# EAGLE design MovingTargetUnit_v4 (EAGLE 9.6.2)
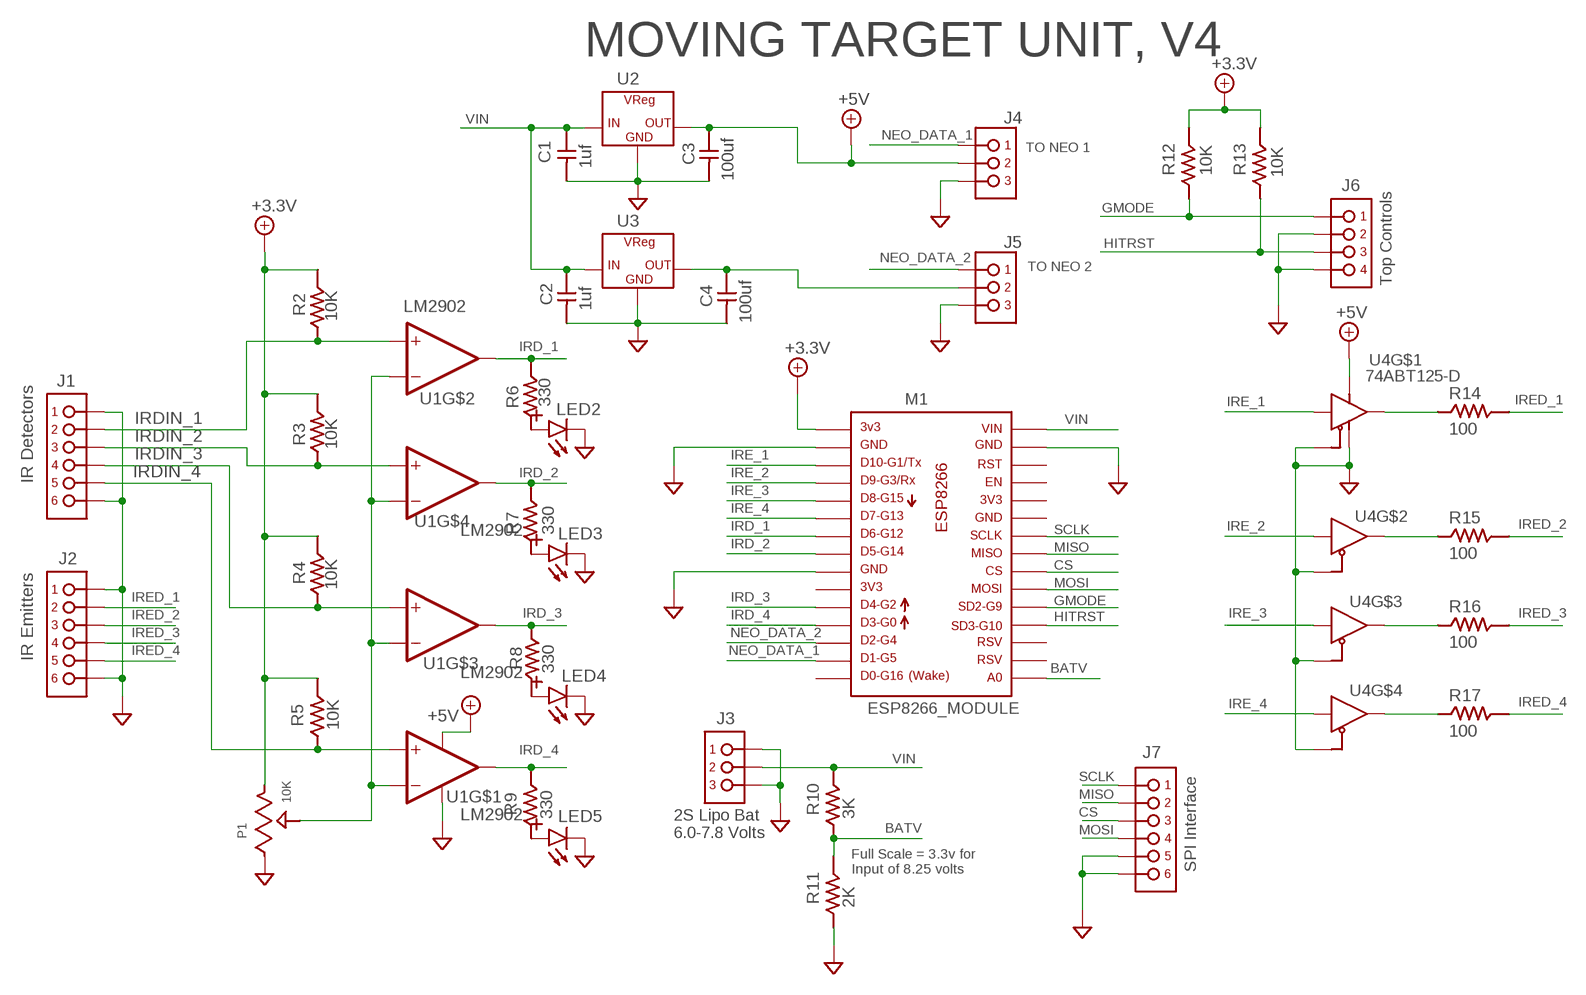
[diagram p0: schematic, sheet 1]

## Parts
C1  1uf  CAP1206  [C1206]
C2  1uf  CAP1206  [C1206]
C3  100uf  CAP1206  [C1206]
C4  100uf  CAP1206  [C1206]
J1  PINHDR_1X6-JST  [JST-XH_098_VERT_1X6]
J2  PINHDR_1X6-JST  [JST-XH_098_VERT_1X6]
J3  PINHDR_1X3XH-JST  [JST-XH_098_VERT_1X3]
J4  PINHDR_1X3XH-JST  [JST-XH_098_VERT_1X3]
J5  PINHDR_1X3XH-JST  [JST-XH_098_VERT_1X3]
J6  PINHDR_1X4-JST  [JST-XH_098_VERT_1X4]
J7  PINHDR_1X6-JST  [JST-XH_098_VERT_1X6]
LED2  LED1206  [LED_1206]
LED3  LED1206  [LED_1206]
LED4  LED1206  [LED_1206]
LED5  LED1206  [LED_1206]
M1  ESP8266_MODULE  [ESP8266_MODULE]
P1  10K  TRIMPOT-SM  [TRIMPOT_3361P]
R2  10K  R1206(3216METRIC)  [R1206]
R3  10K  R1206(3216METRIC)  [R1206]
R4  10K  R1206(3216METRIC)  [R1206]
R5  10K  R1206(3216METRIC)  [R1206]
R6  330  R1206(3216METRIC)  [R1206]
R7  330  R1206(3216METRIC)  [R1206]
R8  330  R1206(3216METRIC)  [R1206]
R9  330  R1206(3216METRIC)  [R1206]
R10  3K  R1206(3216METRIC)  [R1206]
R11  2K  R1206(3216METRIC)  [R1206]
R12  10K  R1206(3216METRIC)  [R1206]
R13  10K  R1206(3216METRIC)  [R1206]
R14  100  R1206(3216METRIC)  [R1206]
R15  100  R1206(3216METRIC)  [R1206]
R16  100  R1206(3216METRIC)  [R1206]
R17  100  R1206(3216METRIC)  [R1206]
U1  LM2902  [SO16LNB-14PIN]
U2  VREG-3L7805CDT  [TO252-3]
U3  VREG-3L7805CDT  [TO252-3]
U4  74ABT125-D  [SO16LNB-14PIN]

## Nets
+3.3V: M1.P$1 P1.3 R2.P$2 R3.P$2 R4.P$2 R5.P$2 R12.P$2 R13.P$2
+5V: C3.P$2 J4.2 U1.P$4(P+) U2.3(OUT) U4.P$14(VCC)
BATV: M1.P$16 R10.P$1 R11.P$2
CS: J7.4 M1.P$22
GMODE: J6.1 M1.P$20 R12.P$1
GND: C1.P$1 C2.P$1 C3.P$1 C4.P$1 J1.1 J1.6 J2.1 J2.6 J3.1 J3.3 J4.1 J5.1 J6.2 J6.4 J7.1 J7.2 LED2.CATHODE(-)(CATHODE) LED3.CATHODE(-)(CATHODE) LED4.CATHODE(-)(CATHODE) LED5.CATHODE(-)(CATHODE) M1.P$2 M1.P$9 M1.P$29 P1.1 R11.P$1 U1.P$11(P-) U2.FIN(GND) U3.FIN(GND) U4.P$1(OE) U4.P$4(OE) U4.P$7(GND) U4.P$10(OE) U4.P$13(OE)
HITRST: J6.3 M1.P$19 R13.P$1
IRD_1: M1.P$7 R6.P$2 U1.P$7(OUT)
IRD_2: M1.P$8 R7.P$2 U1.P$14(OUT)
IRD_3: M1.P$11 R8.P$1 U1.P$8(OUT)
IRD_4: M1.P$12 R9.P$2 U1.P$1(OUT)
IRDIN_1: J1.5 R2.P$1 U1.P$5(+IN)
IRDIN_2: J1.4 R3.P$1 U1.P$12(+IN)
IRDIN_3: J1.3 R4.P$1 U1.P$10(+IN)
IRDIN_4: J1.2 R5.P$1 U1.P$3(+IN)
IRE_1: M1.P$3 U4.P$2(IN)
IRE_2: M1.P$4 U4.P$5(IN)
IRE_3: M1.P$5 U4.P$9(IN)
IRE_4: M1.P$6 U4.P$12(IN)
IRED_1: J2.5 R14.P$2
IRED_2: J2.4 R15.P$2
IRED_3: J2.3 R16.P$2
IRED_4: J2.2 R17.P$2
IREDD_1: R14.P$1 U4.P$3(OUT)
IREDD_2: R15.P$1 U4.P$6(OUT)
IREDD_3: R16.P$1 U4.P$8(OUT)
IREDD_4: R17.P$1 U4.P$11(OUT)
MISO: J7.5 M1.P$23
MOSI: J7.3 M1.P$21
N$1: LED3.ANODE(+)(ANODE) R7.P$1
N$2: LED2.ANODE(+)(ANODE) R6.P$1
N$3: LED4.ANODE(+)(ANODE) R8.P$2
N$4: LED5.ANODE(+)(ANODE) R9.P$1
N$10: P1.2 U1.P$2(-IN) U1.P$6(-IN) U1.P$9(-IN) U1.P$13(-IN)
N$12: C4.P$2 J5.2 U3.3(OUT)
NEO_DATA_1: J4.3 M1.P$14
NEO_DATA_2: J5.3 M1.P$13
SCLK: J7.6 M1.P$24
VIN: C1.P$2 C2.P$2 J3.2 M1.P$30 R10.P$2 U2.1(IN) U3.1(IN)
Unconnected: M1.P$10 M1.P$15 M1.P$17 M1.P$18 M1.P$25 M1.P$26 M1.P$27 M1.P$28

## Notes on the sheet
- MOVING TARGET UNIT, V4
- TO NEO 1
- TO NEO 2
- Top Controls
- IR Detectors
- IR Emitters
- 2S Lipo Bat
  6.0-7.8 Volts
- SPI Interface
- Full Scale = 3.3v for 
  Input of 8.25 volts

## Library data of the parts
C1-C4 = Dal_V2:CAP
J1 J2 J7 = Dal_V2:PINHDR_1X6
J3-J5 = Dal_V2:PINHDR_1X3
J6 = Dal_V2:PINHDR_1X4
LED2-LED5 = Dal_V2:LED: Standard LED
M1 = Dal_V2:ESP8266_MODULE
P1 = Dal_V2:TRIMPOT
R2-R17 = Dal_V2:R: Standard Resistor -- Various Sizes and Wattages
U1 = Dal_V2:LM2902: Texas Instruments, LM2902KD
U2 U3 = Dal_V2:VREG-3: 3 Pin Voltage Regulator
U4 = Dal_V2:74ABT125

## Board
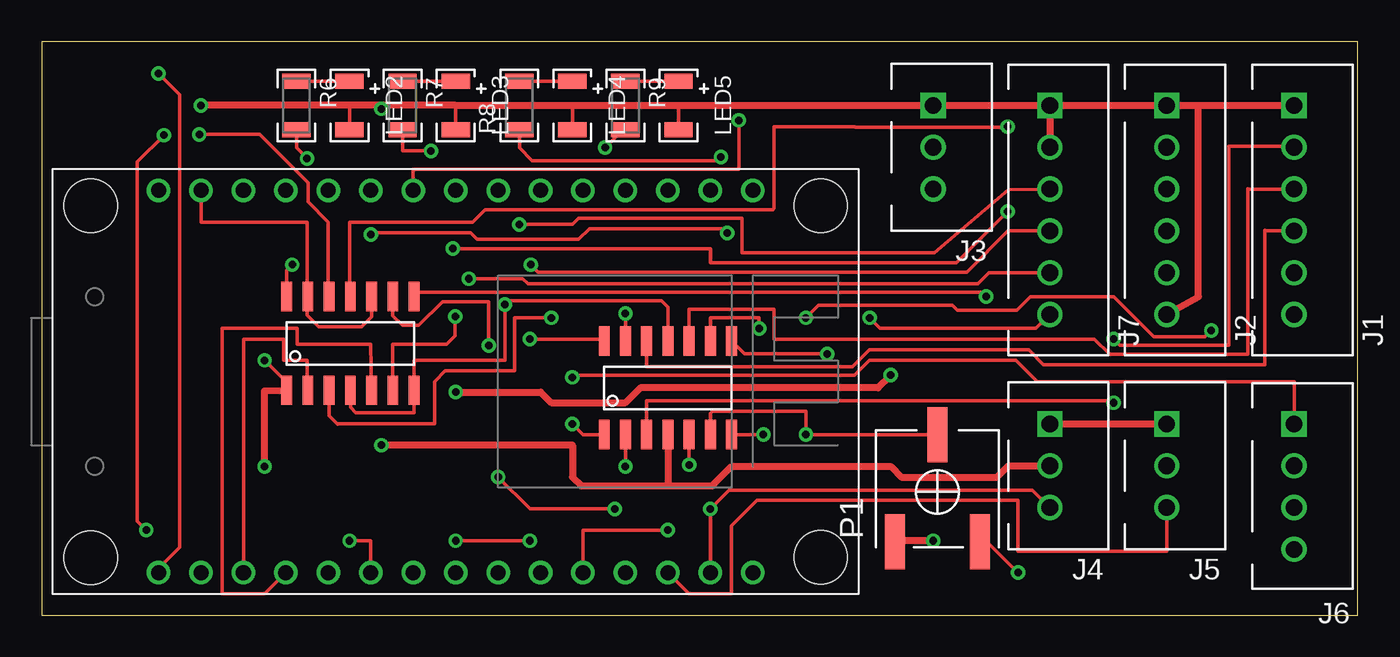
[diagram p1: board, top side]
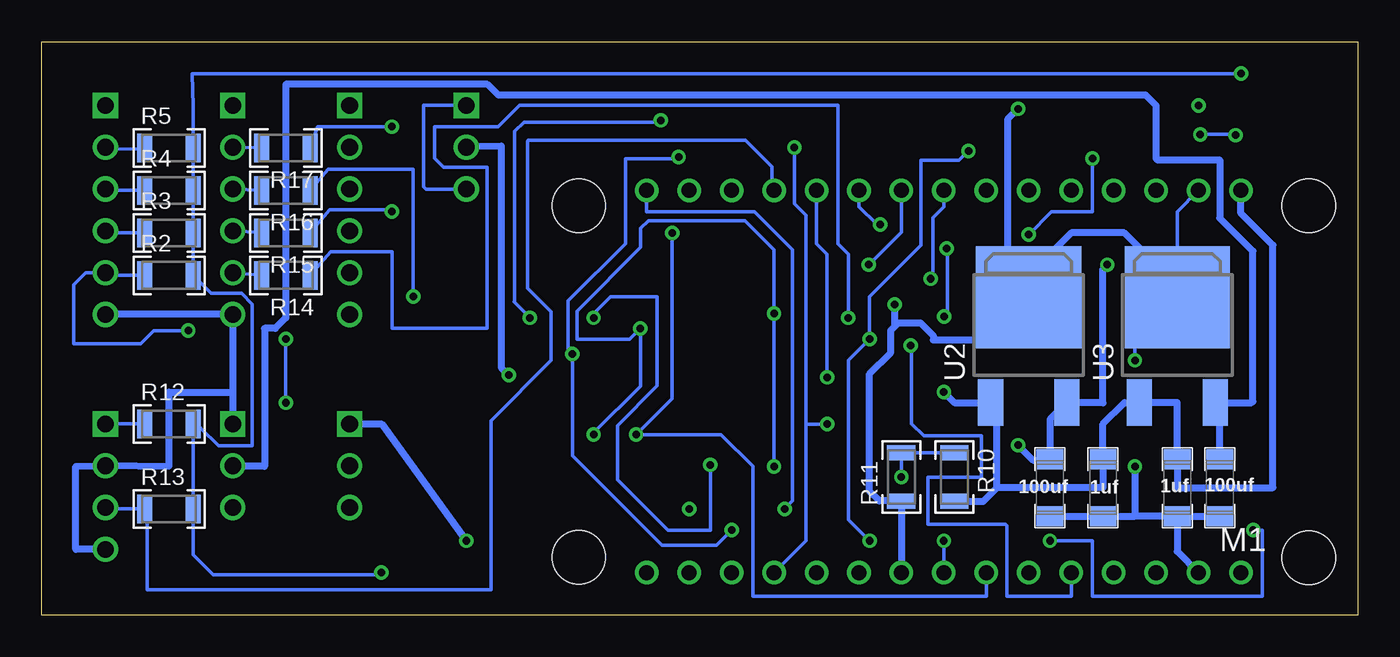
[diagram p2: board, bottom side, seen from below]

Size 78.74 x 34.29 mm. Coordinates in mm from the lower left corner, seen from the top.
Outline: 0,0 78.74,0 78.74,34.29 0,34.29 0,0
Copper layers (1*16): Top 0.035mm / dielectric 1.5mm / Bottom 0.035mm
Design rules "default *": minimum track width 8mil, minimum drill 0.44mm, track to track 8mil, track to pad 8mil, pad to pad 8mil, via to via 8mil, smd to smd 8mil, copper to edge 40mil, drill to drill 6mil, minimum pad ring 10mil, minimum via ring 8mil, stop-mask expansion 4mil, vias tented up to drill 0mil, thermal gap 10mil

### Footprints (pad centres in the part's own frame; a part is rotated, then mirrored left to right if it is on the bottom)
C1206 = smd 1.2 x 1.6: P$1 -1.7,0; P$2 1.7,0
JST-XH_098_VERT_1X6 = drill 1 square: 1 0,0 | drill 1: 2 -2.5,0; 3 -5,0; 4 -7.5,0; 5 -10,0; 6 -12.5,0
JST-XH_098_VERT_1X3 = drill 1 square: 1 0,0 | drill 1: 2 -2.5,0; 3 -5,0
JST-XH_098_VERT_1X4 = drill 1 square: 1 0,0 | drill 1: 2 -2.5,0; 3 -5,0; 4 -7.5,0
LED_1206 = smd 0.9 x 1.7: ANODE(+) -1.45,0; CATHODE(-) 1.45,0
ESP8266_MODULE = drill 0.9: P$1 0,0; P$2 2.54,0; P$3 5.08,0; P$4 7.62,0; P$5 10.16,0; P$6 12.7,0; P$7 15.24,0; P$8 17.78,0; P$9 20.32,0; P$10 22.86,0; P$11 25.4,0; P$12 27.94,0; P$13 30.48,0; P$14 33.02,0; P$15 35.56,0; P$16 35.56,22.86; P$17 33.02,22.86; P$18 30.48,22.86; P$19 27.94,22.86; P$20 25.4,22.86; P$21 22.86,22.86; P$22 20.32,22.86; P$23 17.78,22.86; P$24 15.24,22.86; P$25 12.7,22.86; P$26 10.16,22.86; P$27 7.62,22.86; P$28 5.08,22.86; P$29 2.54,22.86; P$30 0,22.86 | hole 3.175: -4.064,21.946; -4.064,0.889; 39.624,21.946; 39.624,0.914
TRIMPOT_3361P = smd 1.2 x 3.3: 1 -2.54,-6.4; 2 0,0; 3 2.54,-6.4
R1206 = smd 0.9 x 1.7: P$1 -1.45,0; P$2 1.45,0
SO16LNB-14PIN = smd 1.75 x 0.65: P$1 0,0; P$2 0,-1.27; P$3 0,-2.54; P$4 0,-3.81; P$5 0,-5.08; P$6 0,-6.35; P$7 0,-7.62; P$8 5.6,-7.62; P$9 5.6,-6.35; P$10 5.6,-5.08; P$11 5.6,-3.81; P$12 5.6,-2.54; P$13 5.6,-1.27; P$14 5.6,0
TO252-3 = smd 1.5 x 2.8: 1 -2.28,-3.8; 3 2.28,-3.8 | smd 6.3 x 6.1: FIN 0,2.5

### Placement (x,y rotation side)
C1  10.79,7.62 90 bottom
C2  15.24,7.62 90 bottom
C3  18.41,7.62 90 bottom
C4  8.26,7.62 90 bottom
J1  74.93,30.48 90 top
J2  67.31,30.48 90 top
J3  53.34,30.48 90 top
J4  60.33,11.43 90 top
J5  67.31,11.43 90 top
J6  74.93,11.43 90 top
J7  60.33,30.48 90 top
LED2  18.41,30.48 270 top
LED3  24.77,30.48 270 top
LED4  31.75,30.48 270 top
LED5  38.1,30.48 270 top
M1  6.99,2.54 0 top
P1  53.59,10.79 0 top
R2  71.12,20.32 0 bottom
R3  71.12,22.86 0 bottom
R4  71.12,25.4 0 bottom
R5  71.12,27.94 0 bottom
R6  15.24,30.48 270 top
R7  21.59,30.48 270 top
R8  28.57,30.48 90 top
R9  34.92,30.48 270 top
R10  24.13,8.26 270 bottom
R11  27.3,8.26 90 bottom
R12  71.12,11.43 0 bottom
R13  71.12,6.35 0 bottom
R14  64.14,20.32 180 bottom
R15  64.14,22.86 180 bottom
R16  64.14,25.4 180 bottom
R17  64.14,27.94 180 bottom
U1  33.66,10.79 90 top
U2  19.68,16.51 0 bottom
U3  10.79,16.51 0 bottom
U4  14.65,13.45 90 top

### Tracks (layer width: path | path; a pad name or v marks a point on that pad's centre or on a via)
+3.3V  (via drill 0.45)
  Top 0.203: P1.3 56.56,4.39 v58.42,2.54 | M1.P$1 6.99,2.79 8.26,4.06 8.26,31.11 v6.99,32.38
  Bottom 0.203: v58.42,2.54 58.55,2.41 68.48,2.41 69.67,3.61 R13.P$2 R12.P$2 69.22,11.17 68.17,10.12 66.15,10.12 66.15,18.6 66.79,19.24 68.59,19.24 R2.P$2 R3.P$2 R4.P$2 R5.P$2 69.67,30.45 69.75,32.38 v6.99,32.38
+5V  (via drill 0.45)
  Top 0.203: v14.99,20.95 14.65,20.62 U4.P$14
  Top 0.406: v20.32,10.16 31.75,10.16 31.75,8.26 32.28,7.72 37.47,7.72 | U1.P$4 37.47,7.72 | 37.47,7.72 40.11,7.72 41.27,8.89 50.8,8.89 51.44,8.26 57.15,8.26 57.83,8.93 J4.2
  Bottom 0.406: v14.99,20.95 15.24,20.7 15.24,12.7 U2.3 18.41,11.7 C3.P$2 18.46,9.27 19.43,9.27 v20.32,10.16
BATV  (via drill 0.45)
  Top 0.203: v27.3,8.26 29.21,6.35 v34.29,6.35
  Bottom 0.203: R10.P$1 R11.P$2 v27.3,8.26 | M1.P$16 42.55,24.13 36.09,24.13 33.81,21.84 33.81,6.83 v34.29,6.35
CS  (via drill 0.45)
  Top 0.203: v29.26,20.95 29.7,20.51 55.35,20.51 57.82,22.98 J7.4
  Bottom 0.203: v29.26,20.95 27.3,22.91 M1.P$22
GMODE  (via drill 0.45)
  Top 0.203: J6.1 74.93,13.97 59.56,13.97 58.29,15.24 49.53,15.24 48.64,14.35 31.88,14.35 v31.75,14.22
  Bottom 0.203: R12.P$1 J6.1 | M1.P$20 32.38,22.23 31.75,21.59 v31.75,14.22
GND  (via drill 0.45)
  Top 0.203: LED2.CATHODE(-) 18.41,30.48 | 24.77,30.48 LED3.CATHODE(-) | LED4.CATHODE(-) 31.75,30.48 | 38.1,30.48 LED5.CATHODE(-) | 51.05,4.45 P1.1 | 22.27,13.33 22.27,12.09 18.79,12.09 18.46,12.42 U4.P$4 | 22.27,13.33 22.27,15.24 27.71,15.24 v27.71,18.57 27.71,18.8 37.08,18.8 37.47,18.41 U1.P$11 | 22.27,13.33 U4.P$7 | 15.88,19 U4.P$13 | M1.P$29 9.53,23.5 15.88,23.5 15.88,19 | 15.88,19 15.88,17.93 16.56,17.25 19.15,17.25 19.73,17.83 U4.P$10 | v13.34,15.24 14.65,13.92 U4.P$1
  Top 0.406: 20.32,30.48 24.77,30.48 31.75,30.48 38.1,30.48 J3.1 J7.1 | 20.32,30.48 18.41,30.48 v9.53,30.48 | J7.1 J2.1 69.22,30.48 | 69.22,30.48 J1.1 | J2.6 69.22,19.05 69.22,30.48 | J4.1 J5.1 | v53.34,4.45 51.05,4.45 | v13.34,8.89 13.34,13.4 U4.P$1 | J7.1 J7.2 | 20.32,30.48 v20.32,30.28
  Bottom 0.203: J3.1 55.88,30.48 55.88,25.63 55.73,25.48 J3.3 | v13.34,15.24 13.34,17.14 12.7,17.14 10.79,19.05 | 19.68,20.32 19.68,19.15 U2.FIN 18.99,19.23 19.8,20.04 20.95,19.67 | 10.79,19.05 9.53,20.32 | M1.P$29 10.79,24.13 10.79,19.05 | 27.71,17.25 27.88,17.08
  Bottom 0.406: C3.P$1 C2.P$1 13.34,5.92 | C1.P$1 C4.P$1 | C1.P$1 10.79,3.81 M1.P$2 | 67.31,13.34 J2.6 J1.6 | 67.31,13.34 J5.1 | 67.31,13.34 71.12,13.34 71.12,8.91 74.91,8.95 J6.2 76.71,8.89 76.71,3.94 J6.4 | J4.1 58.42,11.43 v53.34,4.45 | v13.34,8.89 13.34,5.92 | 9.53,20.32 12.11,20.32 U3.FIN 10.79,19.68 13.97,22.86 17.14,22.86 19.68,20.32 | C1.P$1 13.34,5.92 | M1.P$9 R11.P$1 27.33,6.83 28.63,6.83 29.21,7.42 29.21,14.43 27.94,15.7 27.94,17.02 27.88,17.08 27.48,17.48 26.16,17.48 25.4,16.71 25.4,16.46 22.38,16.46 19.68,19.15 | v20.32,30.28 20.95,29.65 20.95,19.67 | v27.71,18.57 27.71,17.25
HITRST
  Bottom 0.203: J6.3 74.85,6.35 R13.P$1 72.44,6.22 72.44,1.52 51.87,1.52 51.87,11.63 48.26,15.24 48.26,18.14 49.68,19.56 49.68,28.35 49.63,28.4 36.63,28.4 35.05,26.82 35.05,25.53 M1.P$19
IRD_1  (via drill 0.45)
  Top 0.203: U1.P$7 v43.18,10.79 | v41.02,22.86 40.77,23.11 32.77,23.11 32.13,22.48 26.04,22.48 25.65,22.86 19.68,22.86 v19.68,22.76 | R6.P$2 15.24,27.94 v15.88,27.3
  Bottom 0.203: v41.02,22.86 41.02,12.95 v43.18,10.79 38.1,10.79 36.2,8.89 36.2,1.12 22.23,1.12 M1.P$7 | v19.68,22.76 18.32,24.13 15.88,24.13 v15.88,27.3
IRD_2  (via drill 0.45)
  Top 0.203: U1.P$14 33.66,16.51 v29.21,16.51 | v23.29,27.76 21.59,27.76 R7.P$2 | v24.77,4.45 v29.21,4.45
  Bottom 0.203: M1.P$8 v24.77,4.45 | v29.21,4.45 30.48,5.71 30.48,15.24 v29.21,16.51 29.21,19.05 26.14,22.12 26.14,27.2 23.85,27.2 v23.29,27.76
IRD_3  (via drill 0.45)
  Top 0.203: v46.99,15.62 42.05,15.62 U1.P$8 | v37.47,5.08 32.38,5.08 M1.P$11 | R8.P$1 28.57,27.94 29.34,27.18 40.41,27.18 v40.64,27.4
  Bottom 0.203: v37.47,5.08 38.38,4.17 41.63,4.17 46.99,9.53 v46.99,15.62 47.24,15.88 47.24,18.8 43.81,22.23 43.81,27.3 40.64,27.3 v40.64,27.4
IRD_4  (via drill 0.45)
  Top 0.203: v33.71,27.96 34.77,29.03 R9.P$2 | U1.P$1 32.38,10.79 v31.75,11.43
  Bottom 0.203: M1.P$12 33.02,4.45 33.02,11.4 | v33.71,27.96 33.71,24.61 33.02,23.92 33.02,11.4 | v31.75,11.43 31.77,11.4 33.02,11.4
IRDIN_1  (via drill 0.45)
  Top 0.203: v69.98,17.02 69.6,16.64 66.55,16.64 64.14,19.05 59.16,19.05 58.34,18.24 54.79,18.24 54.48,18.54 46.48,18.54 v45.72,17.78 | U1.P$5 v38.73,8.99
  Bottom 0.203: R2.P$1 74.77,20.32 J1.5 76.12,20.48 76.83,19.76 76.83,16.23 72.82,16.23 72.03,17.02 v69.98,17.02 | v45.72,17.78 45.72,18.03 44.7,19.05 41.92,19.05 41.92,13.71 44.3,11.33 44.3,8.1 41.27,5.08 38.73,5.08 v38.73,8.99
IRDIN_2
  Top 0.203: J1.4 73.18,22.98 73.18,23.01 73.18,14.99 59.94,14.99 59.05,15.88 49.53,15.88 48.51,14.86 36.2,14.86 U1.P$12
  Bottom 0.203: J1.4 74.83,22.88 74.48,22.86 R3.P$1
IRDIN_3
  Top 0.203: J1.3 72.16,25.48 72.16,25.51 72.16,15.6 63.91,15.6 62.99,16.51 43.81,16.51 43.81,18.29 38.73,18.29 U1.P$10
  Bottom 0.203: R4.P$1 74.85,25.4 J1.3
IRDIN_4  (via drill 0.45)
  Top 0.203: U1.P$3 36.2,12.83 64.01,12.83 v64.14,12.7 | v64.14,16.51 64.52,16.13 71.02,16.13 71.02,28.04 74.87,28.04 J1.2
  Bottom 0.203: R5.P$1 72.66,27.85 74.84,27.89 J1.2 | v64.14,12.7 v64.14,16.51
IRE_1
  Top 0.203: M1.P$3 12.06,16.51 14.47,16.51 14.47,15.24 15.88,15.24 15.88,13.5 U4.P$2
IRE_2
  Top 0.203: U4.P$5 19.69,16.2 15.29,16.2 15.29,17.14 10.79,17.14 10.79,1.27 13.34,1.27 M1.P$4
IRE_3  (via drill 0.45)
  Top 0.203: U4.P$9 21,17.91 21.59,17.32 22.55,17.32 23.98,18.75 26.72,18.75 26.72,16.15 v26.75,16.13
  Bottom 0.203: M1.P$5 17.12,2.52 17.12,1.12 20.98,1.12 20.98,5.33 21.08,5.44 25.73,5.44 25.73,8.26 22.5,8.26 22.5,10.72 25.96,10.72 26.7,11.46 26.7,16.08 v26.75,16.13
IRE_4  (via drill 0.45)
  Top 0.203: U4.P$12 17.14,19.1 17.14,23.5 15.93,24.71 15.93,25.86 13.04,28.75 v9.42,28.75 | v6.25,5.08 5.72,5.61 5.72,27.11 v7.32,28.7 | M1.P$6 19.68,4.45 v18.41,4.45
  Bottom 0.203: v9.42,28.75 7.37,28.75 v7.32,28.7 | v18.41,4.45 15.88,4.45 15.88,1.12 5.71,1.12 5.71,5.08 v6.25,5.08
IRED_1
  Bottom 0.203: R14.P$2 J2.5
IRED_2
  Bottom 0.203: R15.P$2 J2.4
IRED_3
  Bottom 0.203: R16.P$2 J2.3
IRED_4
  Bottom 0.203: R17.P$2 J2.2
IREDD_1  (via drill 0.45)
  Top 0.203: U4.P$3 17.2,11.93 17.7,11.42 17.7,11.43 23.5,11.43 23.5,13.97 24.13,14.61 28.3,14.61 28.3,17.78 v30.48,17.78
  Bottom 0.203: R14.P$1 61.46,21.74 57.78,21.74 57.78,17.14 52.09,17.14 52.09,26.77 54.69,26.77 55.24,27.33 55.24,29.21 51.44,29.21 50.16,30.48 31.11,30.48 31.11,22.23 30.48,21.59 v30.48,17.78
IREDD_2  (via drill 0.45)
  Top 0.203: v57.78,24.13 54.74,21.08 40.01,21.08 40.01,21.92 v24.59,21.92 | v24.74,17.86 24.74,16.71 24.23,16.2 20.98,16.2 20.98,13.47 U4.P$6
  Bottom 0.203: R15.P$1 61.51,24.23 57.89,24.23 v57.78,24.13 | v24.59,21.92 24.54,21.87 24.54,18.06 v24.74,17.86
IREDD_3  (via drill 0.45)
  Top 0.203: U4.P$8 22.53,19.3 56.26,19.3 v56.52,19.05
  Bottom 0.203: R16.P$1 61.59,26.67 56.52,26.67 v56.52,19.05
IREDD_4  (via drill 0.45)
  Top 0.203: v57.78,29.21 57.77,29.19 48.68,29.19 48.66,29.21 43.81,29.21 43.81,24.33 43.74,24.25 26.54,24.25 25.78,23.5 18.41,23.5 18.41,19.1 U4.P$11
  Bottom 0.203: R17.P$1 62.23,29.21 v57.78,29.21
MISO  (via drill 0.45)
  Top 0.203: v25.56,20.12 28.78,20.12 29.08,19.81 56.01,19.81 56.67,20.48 J7.5
  Bottom 0.203: v25.56,20.12 25.4,20.27 25.4,23.77 24.77,24.41 M1.P$23
MOSI  (via drill 0.45)
  Top 0.203: v28.57,23.37 31.75,23.37 32.13,23.75 41.91,23.75 41.91,21.66 53.42,21.66 57.83,25.43 J7.3
  Bottom 0.203: M1.P$21 29.84,24.43 28.78,23.37 v28.57,23.37
N$1
  Top 0.203: R7.P$1 LED3.ANODE(+)
N$2
  Top 0.203: R6.P$1 LED2.ANODE(+)
N$3
  Top 0.203: LED4.ANODE(+) R8.P$2
N$4
  Top 0.203: R9.P$1 LED5.ANODE(+)
N$10  (via drill 0.45)
  Top 0.203: U1.P$13 v34.92,18.03 | v34.92,8.89 U1.P$2 | U1.P$9 40.01,17.78 42.93,17.78 v42.93,17.14 | P1.2 v45.72,10.79 45.72,12.19 40.13,12.19 40.01,12.06 U1.P$6
  Bottom 0.203: v34.92,8.89 v34.92,18.03 34.92,21.84 36.67,23.59 42.45,23.59 42.9,23.14 42.9,21.99 46.71,18.18 46.71,16.51 43.56,16.51 v42.93,17.14 42.93,13.69 45.72,10.9 v45.72,10.79
N$12
  Bottom 0.406: J5.2 67.27,8.89 65.41,8.89 65.41,17.14 64.77,17.14 64.14,17.78 64.14,31.75 52.07,31.75 51.44,31.11 12.7,31.11 12.06,30.48 12.06,27.3 11.99,27.23 8.26,27.23 8.26,23.75 6.27,21.77 6.27,12.78 6.34,12.71 U3.3 8.26,12.45 C4.P$2
NEO_DATA_1  (via drill 0.45)
  Top 0.203: M1.P$14 v40.01,6.35 41.12,7.47 59.29,7.47 J4.3
NEO_DATA_2
  Top 0.203: J5.3 67.31,3.81 58.42,3.81 58.42,6.86 42.8,6.86 41.27,5.33 41.27,1.27 38.73,1.27 M1.P$13
SCLK  (via drill 0.45)
  Top 0.203: v49.53,17.78 50.16,17.14 59.49,17.14 J7.6 | M1.P$24 22.23,26.67 41.71,26.67 v41.71,29.59
  Bottom 0.203: v49.53,17.78 50.49,18.75 50.44,18.8 50.44,28.93 49.89,29.49 41.81,29.49 v41.71,29.59
VIN  (via drill 0.45)
  Top 0.406: v24.77,13.34 29.84,13.34 30.48,12.7 34.92,12.7 35.81,13.59 50.04,13.59 v50.8,14.35
  Bottom 0.203: 21.59,12.34 U2.1
  Bottom 0.406: R10.P$2 22.41,6.8 21.59,7.62 | 21.59,7.62 21.59,12.34 | J3.2 53.24,28.08 51.26,28.05 51.26,14.81 v50.8,14.35 | 21.59,7.62 15.24,7.62 C2.P$2 15.24,11.43 13.96,12.71 U3.1 10.8,12.71 10.79,12.7 C1.P$2 10.79,7.62 5.08,7.62 5.08,22.12 6.99,24.03 M1.P$30 | v24.77,13.34 24.13,12.7 U2.1

### Text on the board
tValues: PWR: 6-9v | - + - | - + - | SPI | IR EMITTERS | IR DETECTORS | 74ABT125 | Hit Detector | EpicFMS -- Sept 2021 | dlb, v1. Epic Robotz | NEOPX 1 | NEOPX 2 | SWITCHES
bValues: 3L7805 | 3L7805